# EAGLE schematic mrf89_v0.1 (EAGLE 6.5.0)
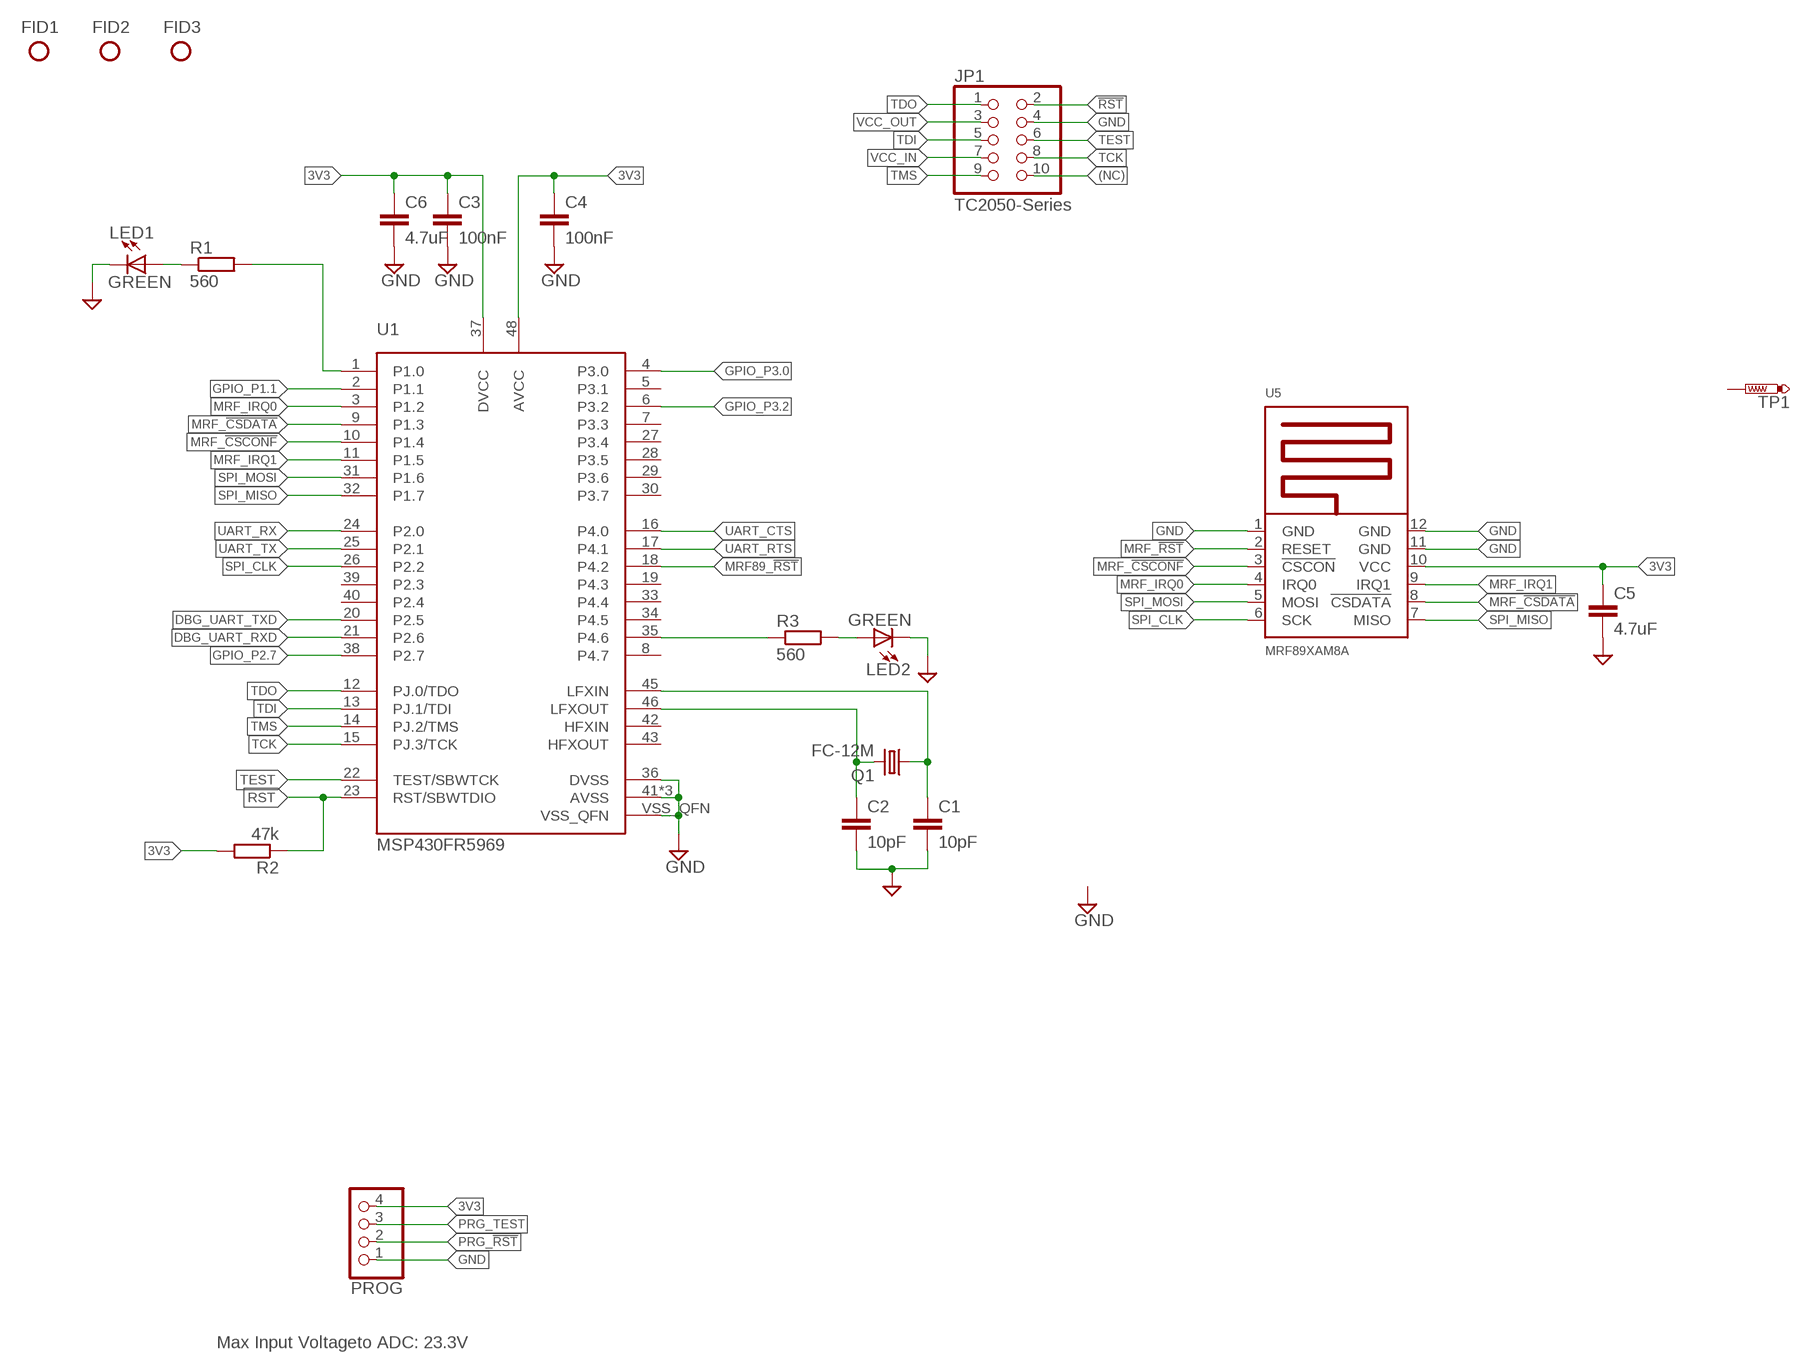
[diagram p0: schematic, sheet 1]

## Parts
C1  10pF  C-EUC0603  [C0603]
C2  10pF  C-EUC0603  [C0603]
C3  100nF  C-EUC0603  [C0603]
C4  100nF  C-EUC0603  [C0603]
C5  4.7uF  C-EUC0805  [C0805]
C6  4.7uF  C-EUC0805  [C0805]
FID1  FIDUCIAL  [FIDUCIAL]
FID2  FIDUCIAL  [FIDUCIAL]
FID3  FIDUCIAL  [FIDUCIAL]
JP1  TC2050-Series  PINHD-2X5  [2X05]
LED1  GREEN  LEDCHIP-LED0603  [CHIP-LED0603]
LED2  GREEN  LEDCHIP-LED0603  [CHIP-LED0603]
PROG  PINHD-1X4  [1X04]
Q1  FC-12M  [FC-12M]
R1  560  R-EU_R0603  [R0603]
R2  47k  R-EU_R0603  [R0603]
R3  560  R-EU_R0603  [R0603]
TP1  PTR1PAD1-13  [P1-13]
U1  MSP430FR5969  [S-PVQFN-N48]
U5  MRF89XAM8A  [MRF89XAMXA]

## Nets
3V3: C3.1 C4.1 C5.1 C6.1 PROG.4 R2.2 U1.37(DVCC) U1.48(AVCC) U5.10(VCC)
!RST: JP1.2
(NC): JP1.10
DBG_UART_RXD: U1.21(P2.6)
DBG_UART_TXD: U1.20(P2.5)
GND: C1.2 C2.2 C3.2 C4.2 C5.2 C6.2 JP1.4 LED1.C LED2.C PROG.1 U1.36(DVSS) U1.41(AVSS) U1.44(AVSS) U1.47(AVSS) U1.VSS_QFN U5.1(GND) U5.11(GND) U5.12(GND)
GPIO_P1.1: U1.2(P1.1)
GPIO_P2.7: U1.38(P2.7)
GPIO_P3.0: U1.4(P3.0)
GPIO_P3.2: U1.6(P3.2)
MRF89_!RST: U1.18(P4.2)
MRF_!CSCONF: U1.10(P1.4) U5.3(!CSCON)
MRF_!CSDATA: U1.9(P1.3) U5.8(!CSDATA)
MRF_!RST: U5.2(RESET)
MRF_IRQ0: U1.3(P1.2) U5.4(IRQ0)
MRF_IRQ1: U1.11(P1.5) U5.9(IRQ1)
N$1: C1.1 Q1.1 U1.45(LFXIN)
N$2: C2.1 Q1.2 U1.46(LFXOUT)
N$4: R3.1 U1.35(P4.6)
N$8: LED2.A R3.2
N$16: R1.2 U1.1(P1.0)
N$17: LED1.A R1.1
PRG_!RST: PROG.2
PRG_TEST: PROG.3
RST: R2.1 U1.23(RST/SBWTDIO)
SPI_CLK: U1.26(P2.2) U5.6(SCK)
SPI_MISO: U1.32(P1.7) U5.7(MISO)
SPI_MOSI: U1.31(P1.6) U5.5(MOSI)
TCK: JP1.8 U1.15(PJ.3/TCK)
TDI: JP1.5 U1.13(PJ.1/TDI)
TDO: JP1.1 U1.12(PJ.0/TDO)
TEST: JP1.6 U1.22(TEST/SBWTCK)
TMS: JP1.9 U1.14(PJ.2/TMS)
UART_CTS: U1.16(P4.0)
UART_RTS: U1.17(P4.1)
UART_RX: U1.24(P2.0)
UART_TX: U1.25(P2.1)
VCC_IN: JP1.7
VCC_OUT: JP1.3
Unconnected: TP1.TP U1.5(P3.1) U1.7(P3.3) U1.8(P4.7) U1.19(P4.3) U1.27(P3.4) U1.28(P3.5) U1.29(P3.6) U1.30(P3.7) U1.33(P4.4) U1.34(P4.5) U1.39(P2.3) U1.40(P2.4) U1.42(HFXIN) U1.43(HFXOUT)

## Notes on the sheet
- Max Input Voltageto ADC: 23.3V

## Library data of the parts
C1-C6 = rcl:C-EU: CAPACITOR, European symbol
FID1-FID3 = testpad:FIDUCIAL
JP1 = pinhead:PINHD-2X5: PIN HEADER
LED1 LED2 = led:LED: LED OSRAM: - CHIPLED LG R971, LG N971, LY N971, LG Q971, LY Q971, LO R971, LY R971 LH N974, LH R974 LS Q976, LO Q976, LY Q976 LO Q996 - Hyper CHIPLED LW Q18S LB Q993, LB Q99A, LB R99A - SideLED LS A670, LO A670, LY A670, LG A670, LP A670 LB A673, LV A673, LT A673, LW A673 LH A674 LY A675 LS A676, LA A676, LO A676, LY A676, LW A676 LS A679, LY A679, LG A679 - Hyper Micro SIDELED® LS Y876, LA Y876, LO Y876, LY Y876 LT Y87S - SmartLED LW L88C, LW L88S LB L89C, LB L89S, LG L890 LS L89K, LO L89K, LY L89K LS L896, LA L896, LO L896, LY L896 - TOPLED LS T670, LO T670, LY T670, LG T670, LP T670 LSG T670, LSP T670, LSY T670, LOP T670, LYG T670 LG T671, LOG T671, LSG T671 LB T673, LV T673, LT T673, LW T673 LH T674 LS T676, LA T676, LO T676, LY T676, LB T676, LH T676, LSB T676, LW T676 LB T67C, LV T67C, LT T67C, LS T67K, LO T67K, LY T67K, LW E67C LS E67B, LA E67B, LO E67B, LY E67B, LB E67C, LV E67C, LT E67C LW T67C LS T679, LY T679, LG T679 LS T770, LO T770, LY T770, LG T770, LP T770 LB T773, LV T773, LT T773, LW T773 LH T774 LS E675, LA E675, LY E675, LS T675 LS T776, LA T776, LO T776, LY T776, LB T776 LHGB T686 LT T68C, LB T68C - Hyper Mini TOPLED® LB M676 - Mini TOPLED Santana® LG M470 LS M47K, LO M47K, LY M47K Source: http://www.osram.convergy.de LUXEON: - LUMILED® LXK2-PW12-R00, LXK2-PW12-S00, LXK2-PW14-U00, LXK2-PW14-V00 LXK2-PM12-R00, LXK2-PM12-S00, LXK2-PM14-U00 LXK2-PE12-Q00, LXK2-PE12-R00, LXK2-PE12-S00, LXK2-PE14-T00, LXK2-PE14-U00 LXK2-PB12-K00, LXK2-PB12-L00, LXK2-PB12-M00, LXK2-PB14-N00, LXK2-PB14-P00, LXK2-PB14-Q00 LXK2-PR12-L00, LXK2-PR12-M00, LXK2-PR14-Q00, LXK2-PR14-R00 LXK2-PD12-Q00, LXK2-PD12-R00, LXK2-PD12-S00 LXK2-PH12-R00, LXK2-PH12-S00 LXK2-PL12-P00, LXK2-PL12-Q00, LXK2-PL12-R00 Source: www.luxeon.com KINGBRIGHT: KA-3528ASYC Source: www.kingbright.com
PROG = pinhead:PINHD-1X4: PIN HEADER
Q1 = crystal:FC-12M: kHz RANGE CRYSTAL UNIT LOW PROFILE SMD Source: Epson Toyocom FC-12M.pdf
R1-R3 = rcl:R-EU_: RESISTOR, European symbol
TP1 = testpad:PTR1: TEST PIN
U1 = chips:MSP430FR5969
U5 = microchip_rf:MRF89XAM8A: Microchip MRF89XAM8A 868MHz Module